# Altium schematic sheet Regulation_PID.SchDoc
size A3; Author: TNI; Organization: ETML-ES; Address1: Avenue Recordon 1; Address2: 1004 Lausanne; Address3: Switzerland; Revision: 1; SheetNumber: 3; SheetTotal: 3; SPICEModelCacheUXNEWWRB: <root> / <DocumentId>UXNEWWRB</DocumentId> / </root>; Version: 2226_A
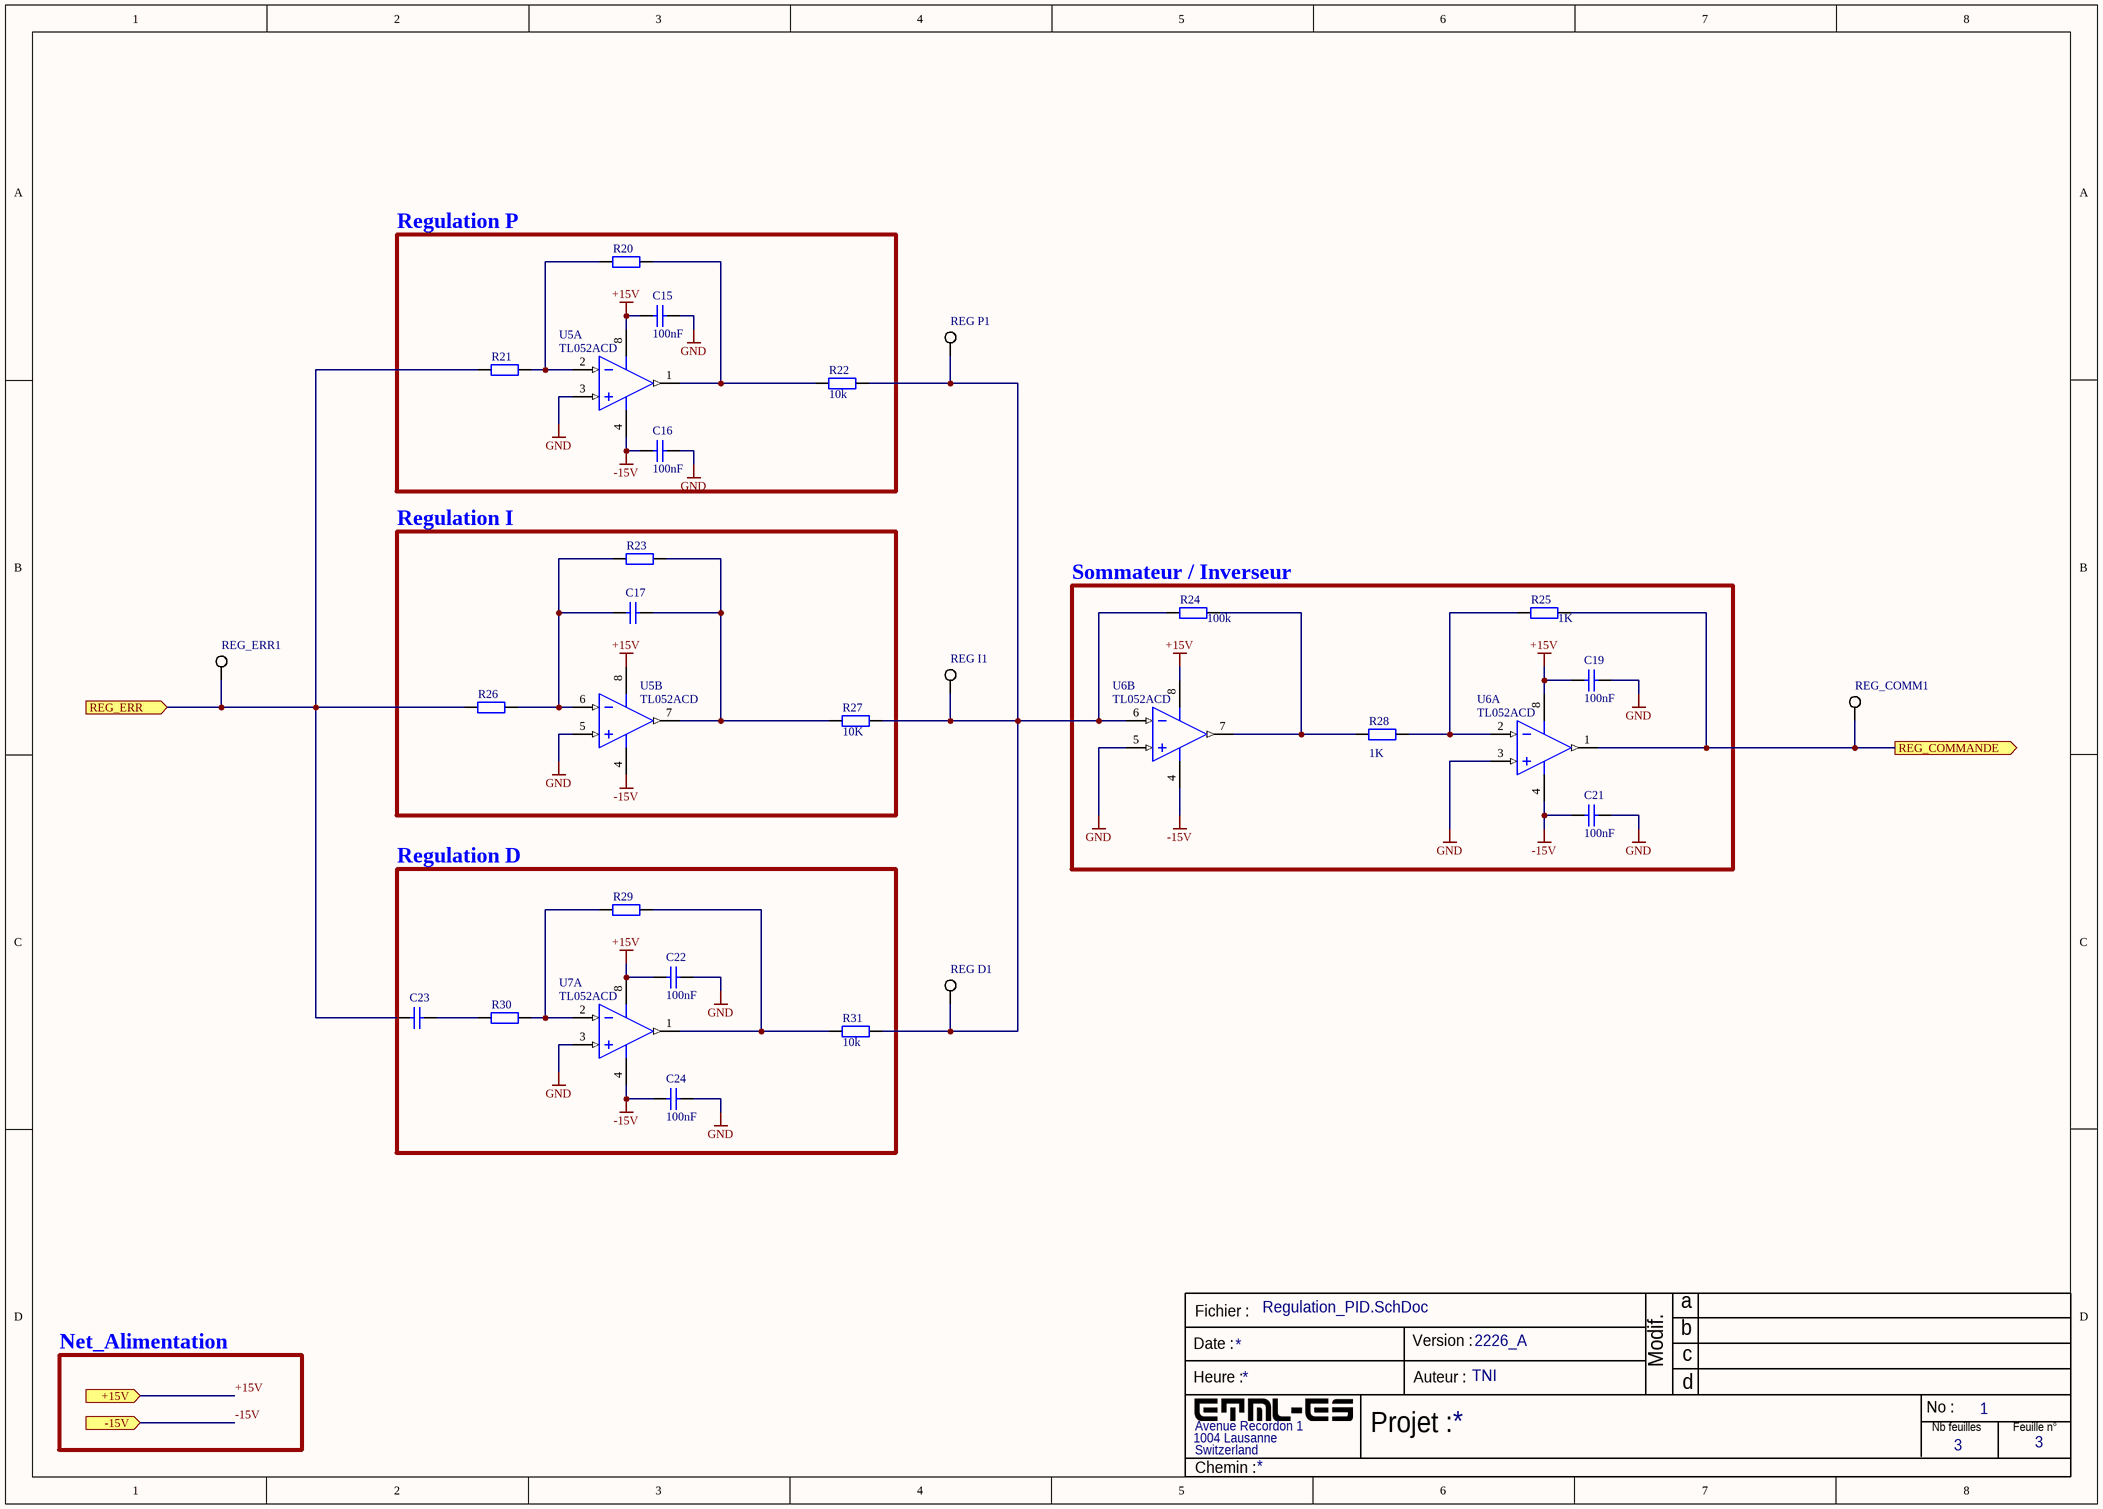
[diagram p0: Regulation_PID.SchDoc]

## Parts
C15  value 100nF  [C0805]  (hidden comment: Cap)
C16  value 100nF  [C0805]  (hidden comment: Cap)
C17  Cap  [AXIAL-0.4]  (value not drawn)
C19  value 100nF  [C0805]  (hidden comment: Cap)
C21  value 100nF  [C0805]  (hidden comment: Cap)
C22  value 100nF  [C0805]  (hidden comment: Cap)
C23  Cap  [AXIAL-0.4]  (value not drawn)
C24  value 100nF  [C0805]  (hidden comment: Cap)
R20  Res2  [AXIAL-0.4]  (value not drawn)
R21  Res2  [AXIAL-0.4]  (value not drawn)
R22  10k  [AXIAL-0.4]
R23  Res2  [AXIAL-0.4]  (value not drawn)
R24  value 100k  [6-0805_N]  (hidden comment: Res2)
R25  value 1K  [6-0805_N]  (hidden comment: Res2)
R26  Res2  [AXIAL-0.4]  (value not drawn)
R27  10K  [AXIAL-0.4]
R28  value 1K  [6-0805_N]  (hidden comment: Res2)
R29  Res2  [AXIAL-0.4]  (value not drawn)
R30  Res2  [AXIAL-0.4]  (value not drawn)
R31  10k  [AXIAL-0.4]
REG_COMM1  REGP  [KSTN-5019_V]  (value not drawn)
REG_D1  REGP  [KSTN-5019_V]  (value not drawn)
REG_ERR1  REGP  [KSTN-5019_V]  (value not drawn)
REG_I1  REGP  [KSTN-5019_V]  (value not drawn)
REG_P1  REGP  [KSTN-5019_V]  (value not drawn)
U5  TL052ACD  [D0008A_N]  (parts A,B of 2)
U6  TL052ACD  [D0008A_N]  (parts A,B of 2)
U7  TL052ACD  [D0008A_N]  (part A of 2)

## Blocks framed on the sheet
Regulation P: C15 C16 R20-R22 U5
Regulation I: C17 R23 R26 R27 U5
Sommateur / Inverseur: C19 C21 R24 R25 R28 U6
Regulation D: C22-C24 R29-R31 U7

## Ports
+15V (in, see Alimentation[3C], uC_HMI[1D]), -15V (in, see Alimentation[3C]), REG_COMMANDE (out), REG_ERR (in, see Alimentation[3B])

## Nets
+15V: C15.2 C19.2 C22.2 U5.8(VCC+) U6.8(VCC+) U7.8(VCC+) ; port +15V
-15V: C16.2 C21.2 C24.2 U5.4(VCC-) U6.4(VCC-) U7.4(VCC-) ; port -15V
GND: C15.1 C16.1 C19.1 C21.1 C22.1 C24.1 U5.3(IN1+) U5.5(IN2+) U6.3(IN1+) U6.5(IN2+) U7.3(IN1+)
REG_COMMANDE: R25.2 REG_COMM1.1 U6.1(OUT1) ; port REG_COMMANDE
REG_ERR: C23.2 R21.1 R26.1 REG_ERR1.1 ; port REG_ERR
NetC17_1: C17.1 R23.2 R27.1 U5.7(OUT2)
NetC17_2: C17.2 R23.1 R26.2 U5.6(IN2-)
NetC23_1: C23.1 R30.1
NetR20_1: R20.1 R21.2 U5.2(IN1-)
NetR20_2: R20.2 R22.1 U5.1(OUT1)
NetR22_2: R22.2 R24.1 R27.2 R31.2 REG_D1.1 REG_I1.1 REG_P1.1 U6.6(IN2-)
NetR24_2: R24.2 R28.1 U6.7(OUT2)
NetR25_1: R25.1 R28.2 U6.2(IN1-)
NetR29_1: R29.1 R30.2 U7.2(IN1-)
NetR29_2: R29.2 R31.1 U7.1(OUT1)

## Notes on the sheet
- Net_Alimentation
- Fichier :
- a
- Date :
- Heure :
- Version :
- Auteur :
- Modif.
- b
- c
- d
- Projet :
- No :
- Nb feuilles
- Feuille n°
- Chemin :

## Library data of the parts
C15 C16 C19 C21 C22 C24 = Cap: Cap 100nF; Published: 8-Jun-2000; LatestRevisionDate: 17-Jul-2002; LatestRevisionNote: Re-released for DXP Platform.; PackageReference: RAD-0.3; Publisher: Altium Limited; PackageDescription: Radial Cap, Thru-Hole; 2 Leads; 0.3 in Pin Spacing
C17 C23 = Cap: Capacitor; Value: 100pF; Published: 8-Jun-2000; LatestRevisionDate: 17-Jul-2002; LatestRevisionNote: Re-released for DXP Platform.; PackageReference: RAD-0.3; Publisher: Altium Limited; PackageDescription: Radial Cap, Thru-Hole; 2 Leads; 0.3 in Pin Spacing
R20 R21 = Res2: Resistor; Published: 8-Jun-2000; LatestRevisionDate: 17-Jul-2002; LatestRevisionNote: Re-released for DXP Platform.; PackageReference: AXIAL-0.4; Publisher: Altium Limited; PackageDescription: Axial Device, Thru-Hole; 2 Leads; 0.4 in Pin Spacing; Value: -
R22 R27 R31 = Res2: Res 100k; Value: 1K; Published: 8-Jun-2000; LatestRevisionDate: 17-Jul-2002; LatestRevisionNote: Re-released for DXP Platform.; PackageReference: AXIAL-0.4; Publisher: Altium Limited; PackageDescription: Axial Device, Thru-Hole; 2 Leads; 0.4 in Pin Spacing
R23 R26 R29 R30 = Res2: Resistor; Value: 1K; Published: 8-Jun-2000; LatestRevisionDate: 17-Jul-2002; LatestRevisionNote: Re-released for DXP Platform.; PackageReference: AXIAL-0.4; Publisher: Altium Limited; PackageDescription: Axial Device, Thru-Hole; 2 Leads; 0.4 in Pin Spacing
R24 = Res2: Res 100k; Published: 8-Jun-2000; LatestRevisionDate: 17-Jul-2002; LatestRevisionNote: Re-released for DXP Platform.; PackageReference: AXIAL-0.4; Publisher: Altium Limited; PackageDescription: Axial Device, Thru-Hole; 2 Leads; 0.4 in Pin Spacing
R25 R28 = Res2: Res 1k; Published: 8-Jun-2000; LatestRevisionDate: 17-Jul-2002; LatestRevisionNote: Re-released for DXP Platform.; PackageReference: AXIAL-0.4; Publisher: Altium Limited; PackageDescription: Axial Device, Thru-Hole; 2 Leads; 0.4 in Pin Spacing
REG_COMM1 REG_D1 REG_ERR1 REG_I1 REG_P1 = CMP-1672-00008-1: Test Point, 1 Position SMD, RoHS, Tape and Reel; ComponentLink1Description: Manufacturer URL; Package Quantity: 1000; DatasheetVersion: 03/2014; Packaging: Tape and Reel; ComponentLink2URL: http://www.keyelco.com/product-pdf.cfm?p=1357; ComponentLink1URL: http://www.keyelco.com/; Mount: Surface Mount; Contact Plating: Silver; PackageDescription: 1-Pin Surface Mount Device, Body 3.81 x 2.03 mm; Pins: 1; RoHSCompliant: True; Mounting Technology: Surface Mount; ComponentLink2Description: Datasheet; PackageReference: 5019
U5-U7 = CMP-0015-00087-2: Enhanced JFET Precision Dual Operational Amplifier, 10 to 30 V, 0 to 70 degC, 8-pin SOIC (D8), Green (RoHS & no Sb/Br); Manufacturer: Texas Instruments; Rating: Military; Slew Rate(Typ)(V/us): 20.7; Vio (25C)(Max)(mV): 0.8; Vn at 1kHz(Typ)(nV/rtHz): 19; Offset Drift(Typ)(uV/C): 6; Total Supply Voltage(Max)(+5V is 5, +/-5V is 10): 30; Number of Channels: 2; CMRR(Min)(dB): 75; IIB(Max)(pA): 200; GBW(Typ)(MHz): 3; Total Supply Voltage(Min)(+5V is 5, +/-5V is 10): 10; Sub Family: General Purpose Amplifier, High Supply Voltage Amplifier (>=30V); Iq per channel(Max)(mA): 2.8; PartNumber: TL052ACD; Code_JEDEC: MS-012; ComponentLink3Description: Package Specification; ComponentLink2Description: Datasheet; DatasheetVersion: SLOS178A; ComponentLink2URL: http://www.ti.com/lit/ds/symlink/tl052a.pdf; ComponentLink1Description: Manufacturer URL; Mounting Technology: Surface Mount; ComponentLink3URL: http://www.ti.com/litv/pdf/msoi002j; PackageDescription: 8-Pin Plastic Small Outline, Body 4.9 x 3.9 mm, Pitch 1.27 mm; ComponentLink1URL: http://www.ti.com/; Eco-Plan: Green (RoHS & no Sb/Br); PackageVersion: 4040047-3/M, 06/2011; PackageReference: D0008A